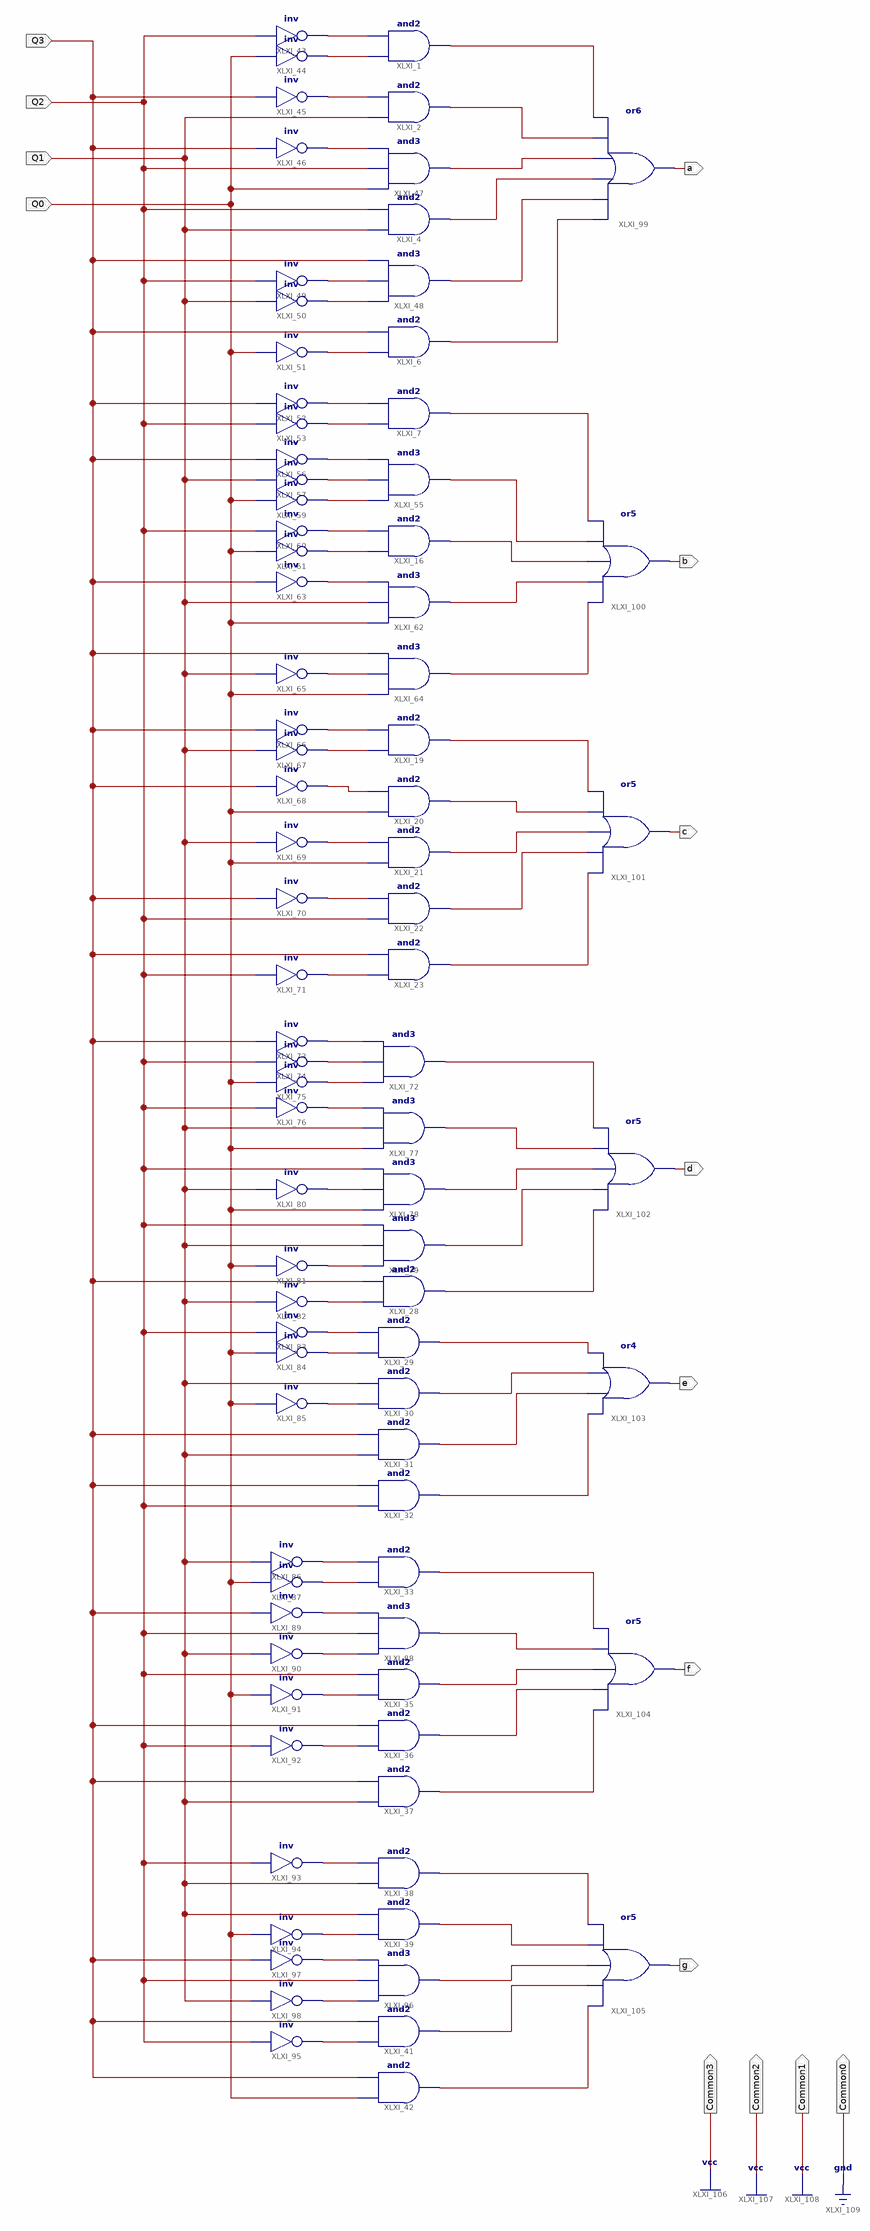
[diagram p0: schematic sheet 1]
// Xilinx ISE schematic BCDtoSegment.sch (spartan6) as structural Verilog: 85 symbols, 15 ports
module BCDtoSegment (
  input  Q0,
  input  Q1,
  input  Q2,
  input  Q3,
  output a,
  output b,
  output c,
  output d,
  output e,
  output f,
  output g,
  output Common3,
  output Common2,
  output Common1,
  output Common0
);

  wire XLXN_1, XLXN_2, XLXN_3, XLXN_4, XLXN_5, XLXN_6, XLXN_7, XLXN_8, XLXN_9, XLXN_10, XLXN_11, XLXN_12,
       XLXN_14, XLXN_15, XLXN_16, XLXN_17, XLXN_18, XLXN_19, XLXN_20, XLXN_21, XLXN_22, XLXN_23, XLXN_24,
       XLXN_25, XLXN_26, XLXN_27, XLXN_28, XLXN_29, XLXN_30, XLXN_31, XLXN_32, XLXN_33, XLXN_34, XLXN_35,
       XLXN_36, XLXN_37, XLXN_38, XLXN_39, XLXN_40, XLXN_41, XLXN_42, XLXN_43, XLXN_44, XLXN_45, XLXN_46,
       XLXN_47, XLXN_48, XLXN_49, XLXN_50, XLXN_51, XLXN_52, XLXN_53, XLXN_54, XLXN_55, XLXN_56, XLXN_57,
       XLXN_58, XLXN_59, XLXN_60, XLXN_61, XLXN_62, XLXN_63, XLXN_64, XLXN_65, XLXN_66, XLXN_67, XLXN_68,
       XLXN_69, XLXN_70, XLXN_71, XLXN_72, XLXN_73, XLXN_74, XLXN_75, XLXN_76, XLXN_77, XLXN_78, XLXN_79;

  and XLXI_1 (XLXN_3, XLXN_2, XLXN_1);
  and XLXI_2 (XLXN_5, Q1, XLXN_4);
  and XLXI_4 (XLXN_11, Q1, Q2);
  and XLXI_6 (XLXN_14, XLXN_12, Q3);
  and XLXI_7 (XLXN_24, XLXN_16, XLXN_15);
  and XLXI_16 (XLXN_26, XLXN_21, XLXN_20);
  and XLXI_19 (XLXN_35, XLXN_30, XLXN_29);
  and XLXI_20 (XLXN_36, Q0, XLXN_31);
  and XLXI_21 (XLXN_37, Q0, XLXN_32);
  and XLXI_22 (XLXN_38, Q2, XLXN_33);
  and XLXI_23 (XLXN_39, XLXN_34, Q3);
  and XLXI_28 (XLXN_51, XLXN_46, Q3);
  and XLXI_29 (XLXN_55, XLXN_53, XLXN_52);
  and XLXI_30 (XLXN_56, XLXN_54, Q1);
  and XLXI_31 (XLXN_57, Q1, Q3);
  and XLXI_32 (XLXN_58, Q2, Q3);
  and XLXI_33 (XLXN_59, XLXN_61, XLXN_60);
  and XLXI_35 (XLXN_67, XLXN_64, Q2);
  and XLXI_36 (XLXN_68, XLXN_65, Q3);
  and XLXI_37 (XLXN_69, Q1, Q3);
  and XLXI_38 (XLXN_75, Q1, XLXN_70);
  and XLXI_39 (XLXN_76, XLXN_71, Q1);
  and XLXI_41 (XLXN_78, XLXN_74, Q3);
  and XLXI_42 (XLXN_79, Q0, Q3);
  not XLXI_43 (XLXN_1, Q2);
  not XLXI_44 (XLXN_2, Q0);
  not XLXI_45 (XLXN_4, Q3);
  not XLXI_46 (XLXN_6, Q3);
  and XLXI_47 (XLXN_7, Q0, Q2, XLXN_6);
  and XLXI_48 (XLXN_10, XLXN_9, XLXN_8, Q3);
  not XLXI_49 (XLXN_8, Q2);
  not XLXI_50 (XLXN_9, Q1);
  not XLXI_51 (XLXN_12, Q0);
  not XLXI_52 (XLXN_15, Q3);
  not XLXI_53 (XLXN_16, Q2);
  and XLXI_55 (XLXN_25, XLXN_19, XLXN_18, XLXN_17);
  not XLXI_56 (XLXN_17, Q3);
  not XLXI_57 (XLXN_18, Q1);
  not XLXI_59 (XLXN_19, Q0);
  not XLXI_60 (XLXN_20, Q2);
  not XLXI_61 (XLXN_21, Q0);
  and XLXI_62 (XLXN_27, Q0, Q1, XLXN_22);
  not XLXI_63 (XLXN_22, Q3);
  and XLXI_64 (XLXN_28, Q0, XLXN_23, Q3);
  not XLXI_65 (XLXN_23, Q1);
  not XLXI_66 (XLXN_29, Q3);
  not XLXI_67 (XLXN_30, Q1);
  not XLXI_68 (XLXN_31, Q3);
  not XLXI_69 (XLXN_32, Q1);
  not XLXI_70 (XLXN_33, Q3);
  not XLXI_71 (XLXN_34, Q2);
  and XLXI_72 (XLXN_47, XLXN_42, XLXN_41, XLXN_40);
  not XLXI_73 (XLXN_40, Q3);
  not XLXI_74 (XLXN_41, Q2);
  not XLXI_75 (XLXN_42, Q0);
  not XLXI_76 (XLXN_43, Q2);
  and XLXI_77 (XLXN_48, Q0, Q1, XLXN_43);
  and XLXI_78 (XLXN_49, Q0, XLXN_44, Q2);
  and XLXI_79 (XLXN_50, XLXN_45, Q1, Q2);
  not XLXI_80 (XLXN_44, Q1);
  not XLXI_81 (XLXN_45, Q0);
  not XLXI_82 (XLXN_46, Q1);
  not XLXI_83 (XLXN_52, Q2);
  not XLXI_84 (XLXN_53, Q0);
  not XLXI_85 (XLXN_54, Q0);
  not XLXI_86 (XLXN_60, Q1);
  not XLXI_87 (XLXN_61, Q0);
  and XLXI_88 (XLXN_66, XLXN_63, Q2, XLXN_62);
  not XLXI_89 (XLXN_62, Q3);
  not XLXI_90 (XLXN_63, Q1);
  not XLXI_91 (XLXN_64, Q0);
  not XLXI_92 (XLXN_65, Q2);
  not XLXI_93 (XLXN_70, Q2);
  not XLXI_94 (XLXN_71, Q0);
  not XLXI_95 (XLXN_74, Q2);
  and XLXI_96 (XLXN_77, XLXN_73, Q2, XLXN_72);
  not XLXI_97 (XLXN_72, Q3);
  not XLXI_98 (XLXN_73, Q1);
  or XLXI_99 (a, XLXN_14, XLXN_10, XLXN_11, XLXN_7, XLXN_5, XLXN_3);
  or XLXI_100 (b, XLXN_28, XLXN_27, XLXN_26, XLXN_25, XLXN_24);
  or XLXI_101 (c, XLXN_39, XLXN_38, XLXN_37, XLXN_36, XLXN_35);
  or XLXI_102 (d, XLXN_51, XLXN_50, XLXN_49, XLXN_48, XLXN_47);
  or XLXI_103 (e, XLXN_58, XLXN_57, XLXN_56, XLXN_55);
  or XLXI_104 (f, XLXN_69, XLXN_68, XLXN_67, XLXN_66, XLXN_59);
  or XLXI_105 (g, XLXN_79, XLXN_78, XLXN_77, XLXN_76, XLXN_75);

  assign Common0 = 1'b0;
  assign Common1 = 1'b1;
  assign Common2 = 1'b1;
  assign Common3 = 1'b1;
endmodule
